# EAGLE design leds_and_button (EAGLE 6.1)
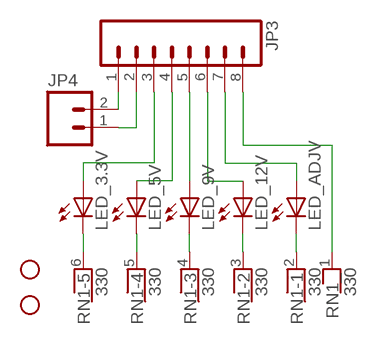
[diagram p0: schematic, sheet 1]

## Parts
JP1  STAND-OFF  [STAND-OFF]
JP2  STAND-OFF  [STAND-OFF]
JP3  M081X08  [1X08]
JP4  M02PTH  [1X02]
LED_3.3V  LED-3MM-NO_SILK  [LED3MM-NS]
LED_5V  LED-3MM-NO_SILK  [LED3MM-NS]
LED_9V  LED-3MM-NO_SILK  [LED3MM-NS]
LED_12V  LED-3MM-NO_SILK  [LED3MM-NS]
LED_ADJV  LED-3MM-NO_SILK  [LED3MM-NS]
RN1  330  RNX5  [RN-6]

## Nets
N$1: JP3.8 RN1.1
N$2: LED_3.3V.K(C) RN1.6
N$3: LED_5V.K(C) RN1.5
N$4: JP3.3 LED_3.3V.A
N$5: JP3.4 LED_5V.A
N$6: JP3.5 LED_9V.A
N$7: JP3.6 LED_12V.A
N$8: LED_9V.K(C) RN1.4
N$9: LED_12V.K(C) RN1.3
N$10: LED_ADJV.K(C) RN1.2
N$11: JP3.1 JP4.2
N$12: JP3.2 JP4.1
N$13: JP3.7 LED_ADJV.A

## Library data of the parts
JP1 JP2 = SparkFun:STAND-OFF: Stand Off This is the mechanical footprint for a #4 phillips button head screw. Use the keepout ring to avoid running the screw head into surrounding components. SKU : PRT-00447
JP3 = SparkFun:M08: Header 8 Standard 8-pin 0.1" header. Use with straight break away headers (SKU : PRT-00116), right angle break away headers (PRT-00553), swiss pins (PRT-00743), machine pins (PRT-00117), and female headers (PRT-00115).
JP4 = SparkFun:M02: Header 2 Standard 2-pin 0.1" header. Use with straight break away headers (SKU : PRT-00116), right angle break away headers (PRT-00553), swiss pins (PRT-00743), machine pins (PRT-00117), and female headers (PRT-00115). Molex polarized connector foot print use with SKU : PRT-08233 with associated crimp pins and housings.
LED_3.3V LED_5V LED_9V LED_12V LED_ADJV = SparkFun:LED: LEDs Standard schematic elements and footprints for 5mm, 3mm, 1206, and 0603 sized LEDs. 5mm - Spark Fun Electronics SKU : COM-00529 (and others)
RN1 = resistor-net:RNX5: RESISTOR NETWORK; OC_FARNELL: unknown; OC_NEWARK: unknown

## Net classes
1 power: width 0.61 mm

## Board
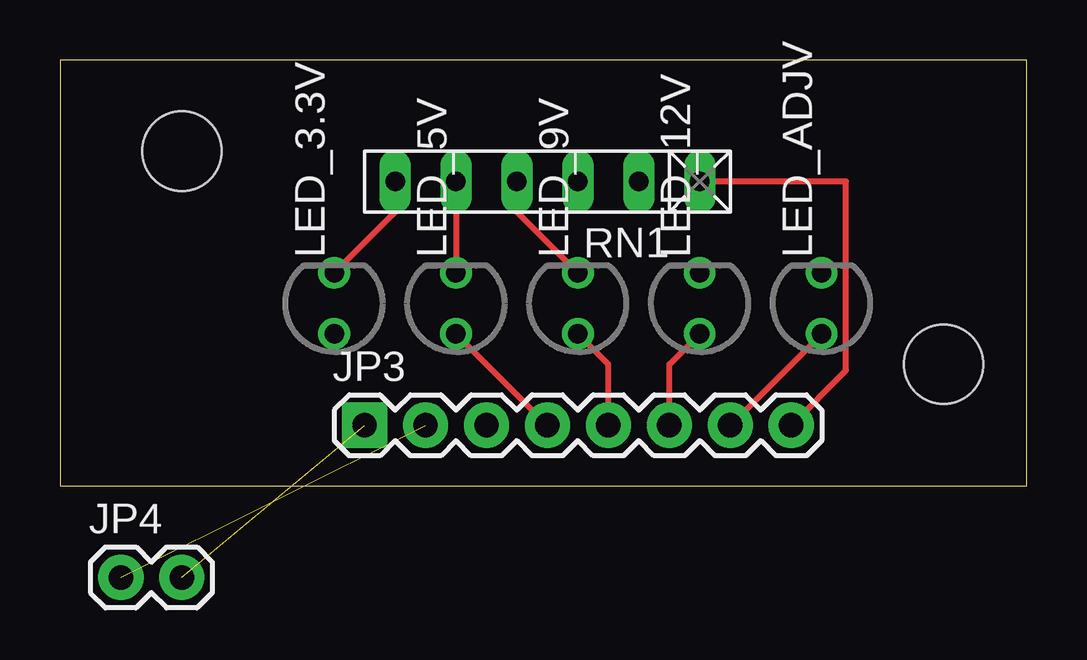
[diagram p1: board, top side]
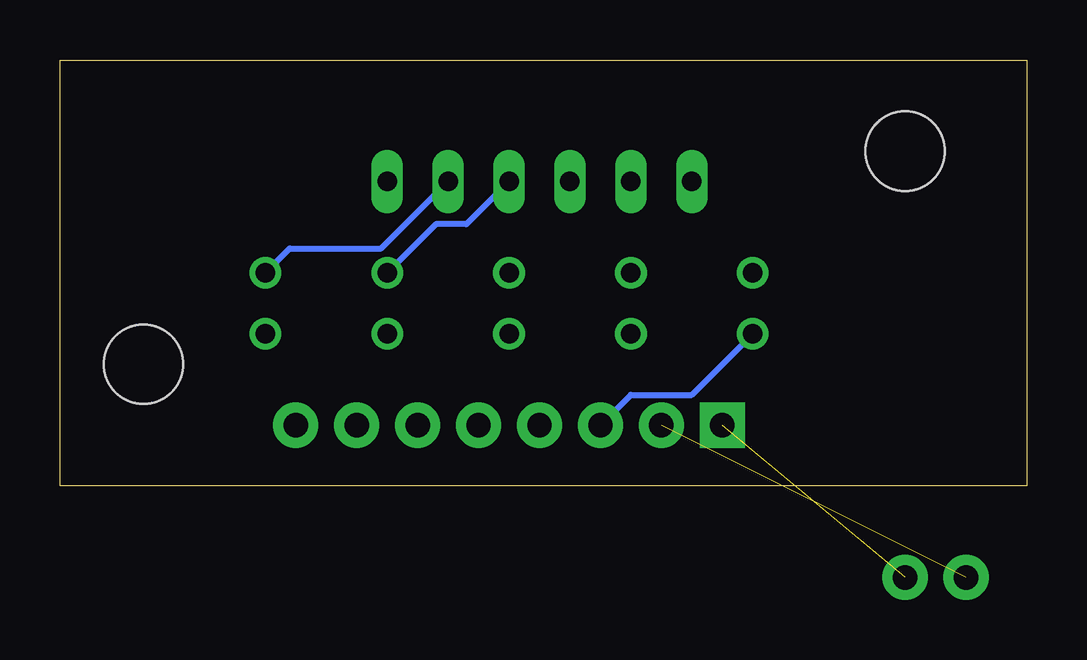
[diagram p2: board, bottom side, seen from below]

Size 40.31 x 17.77 mm. Coordinates in mm from the lower left corner, seen from the top.
Outline: 0,0 40.31,0 40.31,17.77 0,17.77 0,0
Copper layers (1*16): Top 0.035mm / dielectric 1.5mm / Bottom 0.035mm
Design rules: minimum track width 10mil, minimum drill 24mil, track to track 8mil, track to pad 8mil, pad to pad 8mil, via to via 8mil, smd to smd 8mil, copper to edge 40mil, drill to drill 8mil, minimum pad ring 10mil, minimum via ring 8mil, stop-mask expansion 4mil, vias tented up to drill 0mil, thermal gap 10mil

### Footprints (pad centres in the part's own frame; a part is rotated, then mirrored left to right if it is on the bottom)
STAND-OFF = hole 3.302: 0,0
1X08 = drill 1.016 pad 1.88 square: 1 0,0 | drill 1.016 pad 1.88: 2 2.54,0; 3 5.08,0; 4 7.62,0; 5 10.16,0; 6 12.7,0; 7 15.24,0; 8 17.78,0
1X02 = drill 1.016 pad 1.88: 1 0,0; 2 2.54,0
LED3MM-NS = drill 0.813: A -1.27,0; K 1.27,0
RN-6 = drill 0.813 long: 1 -6.35,0; 2 -3.81,0; 3 -1.27,0; 4 1.27,0; 5 3.81,0; 6 6.35,0

### Placement (x,y rotation side)
JP1  36.83,5.08 0 top
JP2  5.08,13.97 0 top
JP3  12.7,2.54 0 top
JP4  2.54,-3.81 0 top  (outside the outline)
LED_3.3V  11.43,7.62 90 top
LED_5V  16.51,7.62 90 top
LED_9V  21.59,7.62 90 top
LED_12V  26.67,7.62 90 top
LED_ADJV  31.75,7.62 90 top
RN1  20.32,12.7 180 top

### Tracks (layer width: path | path; a pad name or v marks a point on that pad's centre or on a via)
N$1
  Top 0.254: RN1.1 32.77,12.7 32.77,4.83 JP3.8
N$2
  Top 0.254: LED_3.3V.K 13.97,11.43 RN1.6
N$3
  Top 0.254: RN1.5 LED_5V.K
N$4
  Bottom 0.254: LED_3.3V.A 13.97,3.81 16.51,3.81 JP3.3
N$5
  Top 0.254: JP3.4 LED_5V.A
N$6
  Top 0.254: LED_9V.A 22.86,5.08 JP3.5
N$7
  Top 0.254: LED_12V.A 25.4,5.08 JP3.6
N$8
  Top 0.254: LED_9V.K 19.05,11.43 RN1.4
N$9
  Bottom 0.254: LED_12V.K 24.64,10.92 23.37,10.92 RN1.3
N$10
  Bottom 0.254: RN1.2 26.92,9.91 30.73,9.91 LED_ADJV.K
N$11  (1 unrouted)
N$12  (1 unrouted)
N$13
  Top 0.254: JP3.7 LED_ADJV.A